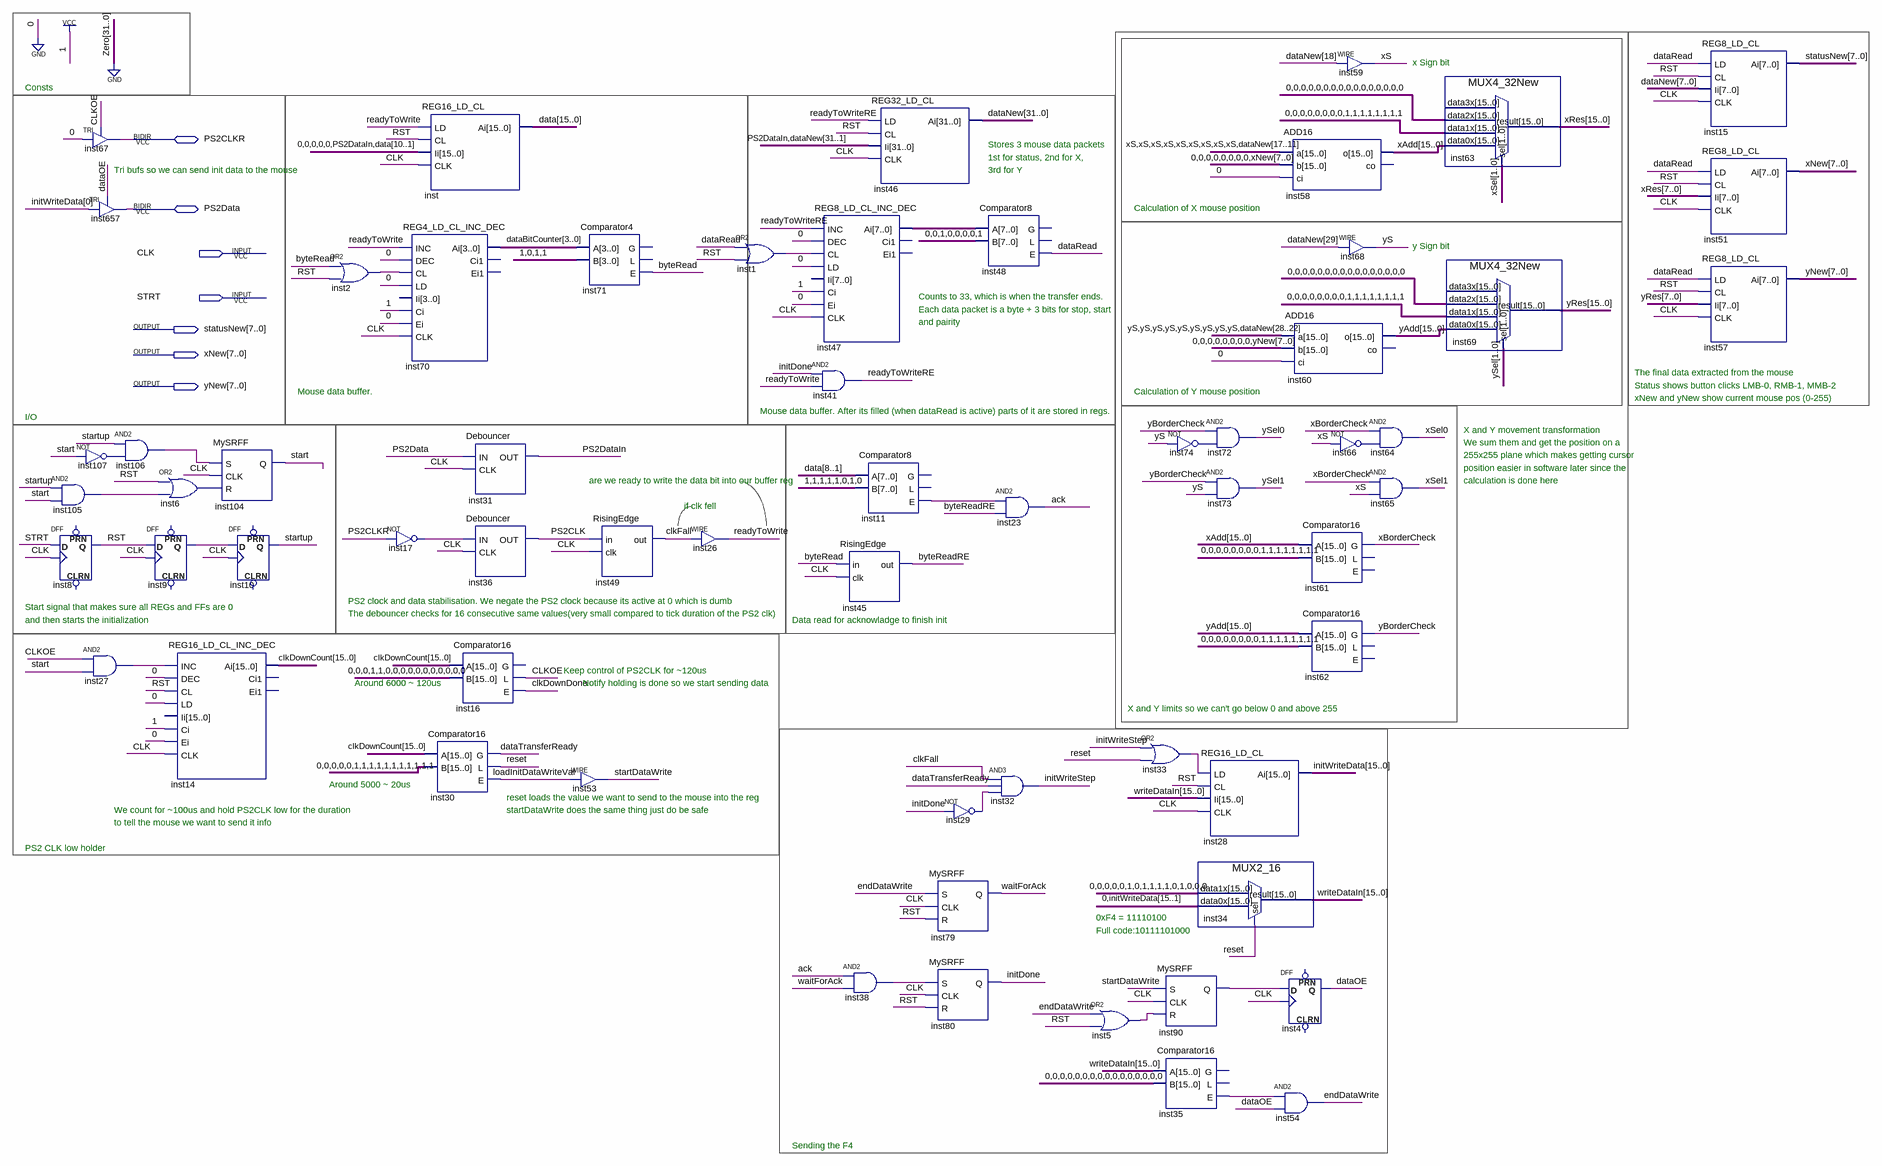
[diagram p0: schematic sheet]
// Quartus schematic PS2Mouse.bdf as structural Verilog: 62 symbols, 7 pins
module PS2Mouse (
  input  CLK,
  input  STRT,
  inout  PS2CLKR,
  inout  PS2Data,
  output [7:0] statusNew,
  output [7:0] xNew,
  output [7:0] yNew
);

  wire ack, byteRead, byteReadRE, clkDownDone, clkFall, CLKOE, dataOE, dataRead, dataTransferReady,
       endDataWrite, initDone, initWriteStep, inst1_out, inst2_out, inst5_out, inst6_out, inst9_q, inst11_e,
       inst17_out, inst27_out, inst29_out, inst33_out, inst35_e, inst38_out, inst66_out, inst74_out,
       inst90_q, inst105_out, inst106_out, inst107_out, loadInitDataWriteVal, PS2CLK, PS2DataIn,
       readyToWrite, readyToWriteRE, reset, RST, start, startDataWrite, startup, waitForAck, xBorderCheck,
       xS, yBorderCheck, yS;
  wire [1:0] xSel, ySel;
  wire [3:0] dataBitCounter;
  wire [7:0] inst47_ai;
  wire [15:0] clkDownCount, data, initWriteData, writeDataIn, xAdd, xRes, yAdd, yRes;
  wire [31:0] dataNew;

  and inst105 (inst105_out, startup, start);
  DFF inst8 (.CLK(CLK), .D(STRT), .Q(RST));  // open: CLRN, PRN
  TRI inst67 (.IN(1'b0), .OE(CLKOE), .OUT(PS2CLKR));
  TRI inst657 (.IN(initWriteData[0]), .OE(dataOE), .OUT(PS2Data));
  and inst106 (inst106_out, startup, inst107_out);
  not inst107 (inst107_out, start);
  and inst27 (inst27_out, CLKOE, start);
  or inst6 (inst6_out, RST, inst105_out);
  DFF inst9 (.CLK(CLK), .D(RST), .Q(inst9_q));  // open: CLRN, PRN
  REG16_LD_CL_INC_DEC inst14 (
    .INC(inst27_out), .DEC(1'b0), .CL(RST), .LD(1'b0), .Ci(1'b1), .Ei(1'b0), .CLK(CLK), .Ai(clkDownCount));  // open: Ii, Ci1, Ei1
  MySRFF inst104 (.S(inst106_out), .CLK(CLK), .R(inst6_out), .Q(start));
  DFF inst10 (.CLK(CLK), .D(inst9_q), .Q(startup));  // open: CLRN, PRN
  or inst2 (inst2_out, byteRead, RST);
  REG16_LD_CL inst (.LD(readyToWrite), .CL(RST), .Ii({{5{1'b0}}, PS2DataIn, data[10:1]}), .CLK(CLK), .Ai(data));
  REG4_LD_CL_INC_DEC inst70 (
    .INC(readyToWrite), .DEC(1'b0), .CL(inst2_out), .LD(1'b0), .Ci(1'b1), .Ei(1'b0), .CLK(CLK),
    .Ai(dataBitCounter));  // open: Ii, Ci1, Ei1
  not inst17 (inst17_out, PS2CLKR);
  Comparator16 inst30 (
    .A(clkDownCount), .B(16'b0000011111111111), .G(dataTransferReady), .L(reset), .E(loadInitDataWriteVal));
  Debouncer inst31 (.IN(PS2Data), .CLK(CLK), .OUT(PS2DataIn));
  Debouncer inst36 (.IN(inst17_out), .CLK(CLK), .OUT(PS2CLK));
  Comparator16 inst16 (.A(clkDownCount), .B(16'b0001100000000000), .L(CLKOE), .E(clkDownDone));  // open: G
  Comparator4 inst71 (.A(dataBitCounter), .B(4'b1011), .E(byteRead));  // open: G, L
  assign startDataWrite = loadInitDataWriteVal;  // WIRE inst53
  RisingEdge inst49 (.in(PS2CLK), .clk(CLK), .out(clkFall));
  assign readyToWrite = clkFall;  // WIRE inst26
  or inst1 (inst1_out, dataRead, RST);
  REG8_LD_CL_INC_DEC inst47 (
    .INC(readyToWriteRE), .DEC(1'b0), .CL(inst1_out), .LD(1'b0), .Ci(1'b1), .Ei(1'b0), .CLK(CLK),
    .Ai(inst47_ai));  // open: Ii, Ci1, Ei1
  and inst41 (readyToWriteRE, initDone, readyToWrite);
  REG32_LD_CL inst46 (.LD(readyToWriteRE), .CL(RST), .Ii({PS2DataIn, dataNew[31:1]}), .CLK(CLK), .Ai(dataNew));
  Comparator8 inst11 (.A(data[8:1]), .B(8'b11111010), .E(inst11_e));  // open: G, L
  RisingEdge inst45 (.in(byteRead), .clk(CLK), .out(byteReadRE));
  and inst38 (inst38_out, ack, waitForAck);
  MySRFF inst79 (.S(endDataWrite), .CLK(CLK), .R(RST), .Q(waitForAck));
  MySRFF inst80 (.S(inst38_out), .CLK(CLK), .R(RST), .Q(initDone));
  Comparator8 inst48 (.A(inst47_ai), .B(8'b00100001), .E(dataRead));  // open: G, L
  not inst29 (inst29_out, initDone);
  and inst23 (ack, inst11_e, byteReadRE);
  and inst32 (initWriteStep, clkFall, dataTransferReady, inst29_out);
  or inst5 (inst5_out, endDataWrite, RST);
  not inst74 (inst74_out, yS);
  or inst33 (inst33_out, initWriteStep, reset);
  MySRFF inst90 (.S(startDataWrite), .CLK(CLK), .R(inst5_out), .Q(inst90_q));
  Comparator16 inst35 (.A(writeDataIn), .B({16{1'b0}}), .E(inst35_e));  // open: G, L
  and inst72 (ySel[0], yBorderCheck, inst74_out);
  and inst73 (ySel[1], yBorderCheck, yS);
  REG16_LD_CL inst28 (.LD(inst33_out), .CL(RST), .Ii(writeDataIn), .CLK(CLK), .Ai(initWriteData));
  MUX2_16 inst34 (
    .data1x(16'b0000010111101000), .data0x({1'b0, initWriteData[15:1]}), .sel(reset), .result(writeDataIn));
  ADD16 inst58 (.a({{9{xS}}, dataNew[17:11]}), .b({{8{1'b0}}, xNew}), .ci(1'b0), .o(xAdd));  // open: co
  ADD16 inst60 (.a({{9{yS}}, dataNew[28:22]}), .b({{8{1'b0}}, yNew}), .ci(1'b0), .o(yAdd));  // open: co
  DFF inst4 (.CLK(CLK), .D(inst90_q), .Q(dataOE));  // open: CLRN, PRN
  and inst54 (endDataWrite, inst35_e, dataOE);
  assign xS = dataNew[18];  // WIRE inst59
  assign yS = dataNew[29];  // WIRE inst68
  not inst66 (inst66_out, xS);
  Comparator16 inst61 (.A(xAdd), .B(16'b0000000011111111), .G(xBorderCheck));  // open: L, E
  Comparator16 inst62 (.A(yAdd), .B(16'b0000000011111111), .G(yBorderCheck));  // open: L, E
  and inst64 (xSel[0], xBorderCheck, inst66_out);
  and inst65 (xSel[1], xBorderCheck, xS);
  MUX4_32New inst63 (
    .data2x({16{1'b0}}), .data1x(16'b0000000011111111), .data0x(xAdd), .sel(xSel), .result(xRes));  // open: data3x
  MUX4_32New inst69 (
    .data2x({16{1'b0}}), .data1x(16'b0000000011111111), .data0x(yAdd), .sel(ySel), .result(yRes));  // open: data3x
  REG8_LD_CL inst15 (.LD(dataRead), .CL(RST), .Ii(dataNew[7:0]), .CLK(CLK), .Ai(statusNew));
  REG8_LD_CL inst51 (.LD(dataRead), .CL(RST), .Ii(xRes[7:0]), .CLK(CLK), .Ai(xNew));
  REG8_LD_CL inst57 (.LD(dataRead), .CL(RST), .Ii(yRes[7:0]), .CLK(CLK), .Ai(yNew));

  // Notes on the sheet:
  //   x Sign bit
  //   Consts
  //   Stores 3 mouse data packets
  //   1st for status, 2nd for X, 
  //   Tri bufs so we can send init data to the mouse
  //   3rd for Y
  //   Calculation of X mouse position
  //   y Sign bit
  //   Counts to 33, which is when the transfer ends.
  //   Each data packet is a byte + 3 bits for stop, start
  //   and pairity
  //   The final data extracted from the mouse
  //   Status shows button clicks LMB-0, RMB-1, MMB-2
  //   Mouse data buffer. 
  //   Calculation of Y mouse position
  //   xNew and yNew show current mouse pos (0-255)
  //   Mouse data buffer. After its filled (when dataRead is active) parts of it are stored in regs.
  //   I/O
  //   X and Y movement transformation
  //   We sum them and get the position on a
  //   255x255 plane which makes getting cursor
  //   position easier in software later since the
  //   are we ready to write the data bit into our buffer reg
  //   calculation is done here
  //   if clk fell
  //   PS2 clock and data stabilisation. We negate the PS2 clock because its active at 0 which is dumb
  //   Start signal that makes sure all REGs and FFs are 0
  //   The debouncer checks for 16 consecutive same values(very small compared to tick duration of the PS2 clk)
  //   and then starts the initialization
  //   Data read for acknowladge to finish init
  //   Keep control of PS2CLK for ~120us
  //   Around 6000 ~ 120us
  //   Notify holding is done so we start sending data
  //   X and Y limits so we can't go below 0 and above 255
  //   Around 5000 ~ 20us
  //   reset loads the value we want to send to the mouse into the reg
  //   We count for ~100us and hold PS2CLK low for the duration
  //   startDataWrite does the same thing just do be safe
  //   to tell the mouse we want to send it info
  //   PS2 CLK low holder
  //   0xF4 = 11110100
  //   Full code:10111101000
  //   Sending the F4 
endmodule
